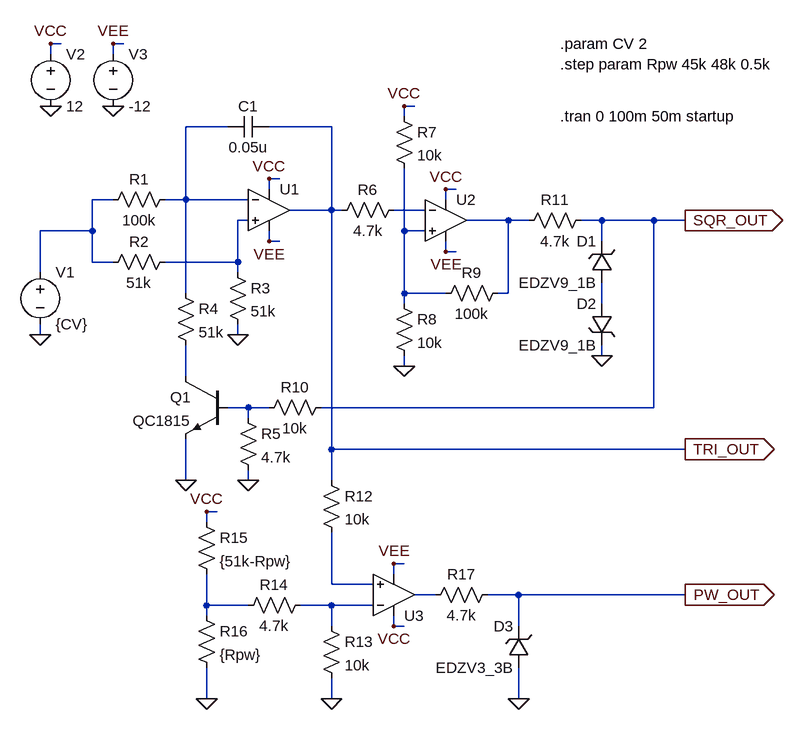
[diagram p0: schematic VCO_TRI_PW.asc]
VCO_TRI_PW.asc, the LTspice schematic file:
Version 4
SHEET 1 1200 932
WIRE -80 -128 -96 -128
WIRE 16 -128 0 -128
WIRE -96 -112 -96 -128
WIRE 0 -112 0 -128
WIRE 464 -32 448 -32
WIRE 448 -16 448 -32
WIRE 176 0 112 0
WIRE 336 0 240 0
WIRE 256 80 240 80
WIRE 240 96 240 80
WIRE 528 96 512 96
WIRE 0 112 -32 112
WIRE 112 112 112 0
WIRE 112 112 80 112
WIRE 208 112 112 112
WIRE 512 112 512 96
WIRE 336 128 336 0
WIRE 336 128 272 128
WIRE 352 128 336 128
WIRE 480 128 432 128
WIRE 208 144 192 144
WIRE 608 144 544 144
WIRE 640 144 608 144
WIRE 752 144 720 144
WIRE 832 144 752 144
WIRE 880 144 832 144
WIRE -32 160 -32 112
WIRE -32 160 -112 160
WIRE 448 160 448 64
WIRE 480 160 448 160
WIRE 240 176 240 160
WIRE 256 176 240 176
WIRE 752 176 752 144
WIRE 512 192 512 176
WIRE 528 192 512 192
WIRE -32 208 -32 160
WIRE 0 208 -32 208
WIRE 192 208 192 144
WIRE 192 208 80 208
WIRE -112 224 -112 160
WIRE 192 224 192 208
WIRE 112 256 112 112
WIRE 448 256 448 160
WIRE 512 256 448 256
WIRE 608 256 608 144
WIRE 608 256 592 256
WIRE 448 272 448 256
WIRE 752 272 752 240
WIRE -112 320 -112 304
WIRE 192 320 192 304
WIRE 752 352 752 336
WIRE 448 368 448 352
WIRE 112 384 112 336
WIRE 208 432 176 432
WIRE 240 432 208 432
WIRE 832 432 832 144
WIRE 832 432 320 432
WIRE 208 448 208 432
WIRE 336 496 336 128
WIRE 880 496 336 496
WIRE 112 544 112 480
WIRE 208 544 208 528
WIRE 336 544 336 496
WIRE 160 592 144 592
WIRE 144 608 144 592
WIRE 448 672 432 672
WIRE 432 688 432 672
WIRE 336 704 336 624
WIRE 400 704 336 704
WIRE 496 720 464 720
WIRE 624 720 576 720
WIRE 880 720 624 720
WIRE 144 736 144 688
WIRE 208 736 144 736
WIRE 336 736 288 736
WIRE 400 736 336 736
WIRE 144 752 144 736
WIRE 336 768 336 736
WIRE 432 768 432 752
WIRE 448 768 432 768
WIRE 624 768 624 720
WIRE 144 880 144 832
WIRE 336 880 336 848
WIRE 624 880 624 832
FLAG 240 80 VCC
FLAG 240 176 VEE
FLAG 192 320 0
FLAG 112 544 0
FLAG 208 544 0
FLAG 512 96 VCC
FLAG 512 192 VEE
FLAG 448 -32 VCC
FLAG 448 368 0
FLAG 880 144 SQR_OUT
IOPIN 880 144 Out
FLAG 752 352 0
FLAG -112 320 0
FLAG -96 -32 0
FLAG 0 -32 0
FLAG -96 -128 VCC
FLAG 0 -128 VEE
FLAG 880 496 TRI_OUT
IOPIN 880 496 Out
FLAG 336 880 0
FLAG 144 880 0
FLAG 144 592 VCC
FLAG 432 672 VEE
FLAG 432 768 VCC
FLAG 880 720 PW_OUT
IOPIN 880 720 Out
FLAG 624 880 0
SYMBOL Opamps\\UniversalOpamp2 240 128 R0
SYMATTR InstName U1
SYMBOL Opamps\\UniversalOpamp2 512 144 R0
SYMATTR InstName U2
SYMBOL res 96 96 R90
WINDOW 0 0 56 VBottom 2
WINDOW 3 32 56 VTop 2
SYMATTR InstName R1
SYMATTR Value 100k
SYMBOL res 96 192 R90
WINDOW 0 0 56 VBottom 2
WINDOW 3 32 56 VTop 2
SYMATTR InstName R2
SYMATTR Value 51k
SYMBOL res 176 208 R0
SYMATTR InstName R3
SYMATTR Value 51k
SYMBOL cap 240 -16 R90
WINDOW 0 0 32 VBottom 2
WINDOW 3 32 32 VTop 2
SYMATTR InstName C1
SYMATTR Value 0.05u
SYMBOL npn 176 384 M0
SYMATTR InstName Q1
SYMATTR Value QC1815
SYMBOL res 96 240 R0
SYMATTR InstName R4
SYMATTR Value 51k
SYMBOL res 192 432 R0
SYMATTR InstName R5
SYMATTR Value 4.7k
SYMBOL res 448 112 R90
WINDOW 0 0 56 VBottom 2
WINDOW 3 32 56 VTop 2
SYMATTR InstName R6
SYMATTR Value 4.7k
SYMBOL res 432 -32 R0
SYMATTR InstName R7
SYMATTR Value 10k
SYMBOL res 432 256 R0
SYMATTR InstName R8
SYMATTR Value 10k
SYMBOL res 608 240 R90
WINDOW 0 0 56 VBottom 2
WINDOW 3 32 56 VTop 2
SYMATTR InstName R9
SYMATTR Value 100k
SYMBOL res 336 416 R90
WINDOW 0 0 56 VBottom 2
WINDOW 3 32 56 VTop 2
SYMATTR InstName R10
SYMATTR Value 10k
SYMBOL res 736 128 R90
WINDOW 0 0 56 VBottom 2
WINDOW 3 32 56 VTop 2
SYMATTR InstName R11
SYMATTR Value 4.7k
SYMBOL zener 768 240 R180
WINDOW 0 24 64 Left 2
WINDOW 3 24 0 Left 2
SYMATTR InstName D1
SYMATTR Value EDZV9_1B
SYMBOL zener 768 272 M0
SYMATTR InstName D2
SYMATTR Value EDZV9_1B
SYMBOL voltage -112 208 R0
WINDOW 123 0 0 Left 2
WINDOW 39 0 0 Left 2
SYMATTR InstName V1
SYMATTR Value {CV}
SYMBOL voltage -96 -128 R0
WINDOW 123 0 0 Left 2
WINDOW 39 0 0 Left 2
SYMATTR InstName V2
SYMATTR Value 12
SYMBOL voltage 0 -128 R0
WINDOW 123 0 0 Left 2
WINDOW 39 0 0 Left 2
SYMATTR InstName V3
SYMATTR Value -12
SYMBOL res 320 528 R0
SYMATTR InstName R12
SYMATTR Value 10k
SYMBOL Opamps\\UniversalOpamp2 432 720 M180
SYMATTR InstName U3
SYMBOL res 320 752 R0
SYMATTR InstName R13
SYMATTR Value 10k
SYMBOL res 304 720 R90
WINDOW 0 0 56 VBottom 2
WINDOW 3 32 56 VTop 2
SYMATTR InstName R14
SYMATTR Value 4.7k
SYMBOL res 128 592 R0
SYMATTR InstName R15
SYMATTR Value {51k-Rpw}
SYMBOL res 128 736 R0
SYMATTR InstName R16
SYMATTR Value {Rpw}
SYMBOL res 592 704 R90
WINDOW 0 0 56 VBottom 2
WINDOW 3 32 56 VTop 2
SYMATTR InstName R17
SYMATTR Value 4.7k
SYMBOL zener 640 832 R180
WINDOW 0 24 64 Left 2
WINDOW 3 24 0 Left 2
SYMATTR InstName D3
SYMATTR Value EDZV3_3B
TEXT 688 -16 Left 2 !.tran 0 100m 50m startup
TEXT 688 -128 Left 2 !.param CV 2
TEXT 688 -96 Left 2 !.step param Rpw 45k 48k 0.5k

The netlist it stands for:
* VCO_TRI_PW.asc
XU1 N004 N001 VCC VEE TRI_OUT level.2 Avol=1Meg GBW=10Meg Slew=10Meg ilimit=25m rail=0 Vos=0 phimargin=45 en=0 enk=0 in=0 ink=0 Rin=500Meg  ; pins IN+ IN- V+ V- OUT
XU2 N006 N003 VCC VEE N005 level.2 Avol=1Meg GBW=10Meg Slew=10Meg ilimit=25m rail=0 Vos=0 phimargin=45 en=0 enk=0 in=0 ink=0 Rin=500Meg  ; pins IN+ IN- V+ V- OUT
R1 N001 N002 100k
R2 N004 N002 51k
R3 N004 0 51k
C1 TRI_OUT N001 0.05u
Q1 N008 N009 0 0 QC1815
R4 N001 N008 51k
R5 N009 0 4.7k
R6 N003 TRI_OUT 4.7k
R7 VCC N006 10k
R8 N006 0 10k
R9 N005 N006 100k
R10 SQR_OUT N009 10k
R11 SQR_OUT N005 4.7k
D1 N007 SQR_OUT EDZV9_1B
D2 N007 0 EDZV9_1B
V1 N002 0 {CV}
V2 VCC 0 12
V3 VEE 0 -12
R12 TRI_OUT N010 10k
XU3 N010 N013 VCC VEE N011 level.2 Avol=1Meg GBW=10Meg Slew=10Meg ilimit=25m rail=0 Vos=0 phimargin=45 en=0 enk=0 in=0 ink=0 Rin=500Meg  ; pins IN+ IN- V+ V- OUT
R13 N013 0 10k
R14 N013 N012 4.7k
R15 VCC N012 {51k-Rpw}
R16 N012 0 {Rpw}
R17 PW_OUT N011 4.7k
D3 0 PW_OUT EDZV3_3B
.model D D
.lib standard.dio
.model NPN NPN
.model PNP PNP
.lib standard.bjt
.tran 0 100m 50m startup
.param CV 2
.step param Rpw 45k 48k 0.5k
.lib UniversalOpamps2.sub
.backanno
.end